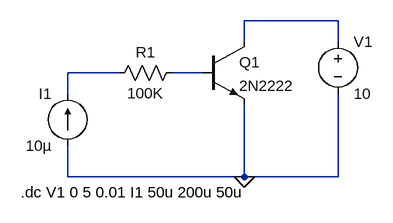
[diagram p0: schematic 2SourceDCSweep.asc]
2SourceDCSweep.asc, the LTspice schematic file:
Version 4
SHEET 1 880 680
WIRE 448 32 304 32
WIRE 304 64 304 32
WIRE 448 64 448 32
WIRE 112 112 32 112
WIRE 240 112 192 112
WIRE 32 144 32 112
WIRE 32 272 32 224
WIRE 304 272 304 160
WIRE 304 272 32 272
WIRE 448 272 448 144
WIRE 448 272 304 272
FLAG 304 272 0
SYMBOL current 32 224 R180
WINDOW 0 24 80 Left 2
WINDOW 3 24 0 Left 2
SYMATTR InstName I1
SYMATTR Value 10µ
SYMBOL res 96 128 R270
WINDOW 0 32 56 VTop 2
WINDOW 3 0 56 VBottom 2
SYMATTR InstName R1
SYMATTR Value 100K
SYMBOL voltage 448 48 R0
SYMATTR InstName V1
SYMATTR Value 10
SYMBOL npn 240 64 R0
SYMATTR InstName Q1
SYMATTR Value 2N2222
TEXT -40 296 Left 2 !.dc V1 0 5 0.01 I1 50u 200u 50u

The netlist it stands for:
* 2SourceDCSweep.asc
I1 0 N002 10µ
R1 N002 N003 100K
V1 N001 0 10
Q1 N001 N003 0 0 2N2222
.model NPN NPN
.model PNP PNP
.lib standard.bjt
.dc V1 0 5 0.01 I1 50u 200u 50u
.backanno
.end